# Altium schematic sheet Clock.SchDoc
size 101 x 76 mm; SheetNumber: 4; SheetTotal: 5
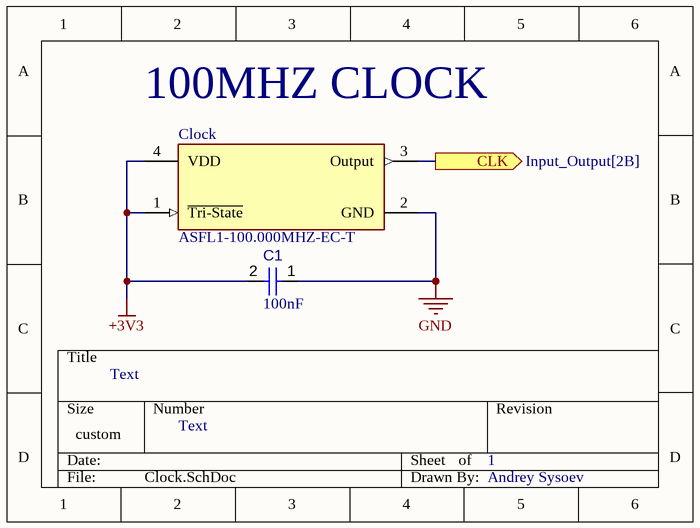
[diagram p0: Clock.SchDoc]

## Parts
Clock  ASFL1-100.000MHZ-EC-T  [FP-ASFL1-MFG]
С1  value 100nF  [CAPC0402(1005)60_L]  (hidden comment: Capacitor 100nF +/-20% 50V 0402)

## Ports
CLK (out, see Input_Output[2B])

## Nets
+3V3: Clock.1(~{Tri-State}) Clock.4(VDD) С1.2
GND: Clock.2(GND) С1.1
CLK: Clock.3(Output) ; port CLK

## Notes on the sheet
- (near Clock) 100MHZ CLOCK
- Text
- 1
- Andrey Sysoev

## Library data of the parts
Clock = CMP-031-00009-1: Oscillator Xo 100MHZ ±50PPM 15PF Hcmos/ttl 60% 3.3V 4-PIN SMD T/r; Min Supply Voltage: 2.97V; Max Supply Voltage: 3.63V; Mounting Technology: Surface Mount; Case/Package: SMD/SMT; Max Operating Temperature: 70°C; Pins: 4; Min Operating Temperature: -20°C
С1 = CMP-001-00067-3: Chip Capacitor, 100nF +/-20%, 50V, 0402, Thickness 0.6 mm; Tolerance: 10%; Min Operating Temperature: -55°C; Pins: 2; Case/Package: 0402; Max Operating Temperature: 85°C; Voltage Rating: 50V; Mounting Technology: SMT